# EAGLE design UNO-Rev3 Breakout v10 (EAGLE 9.6.2)
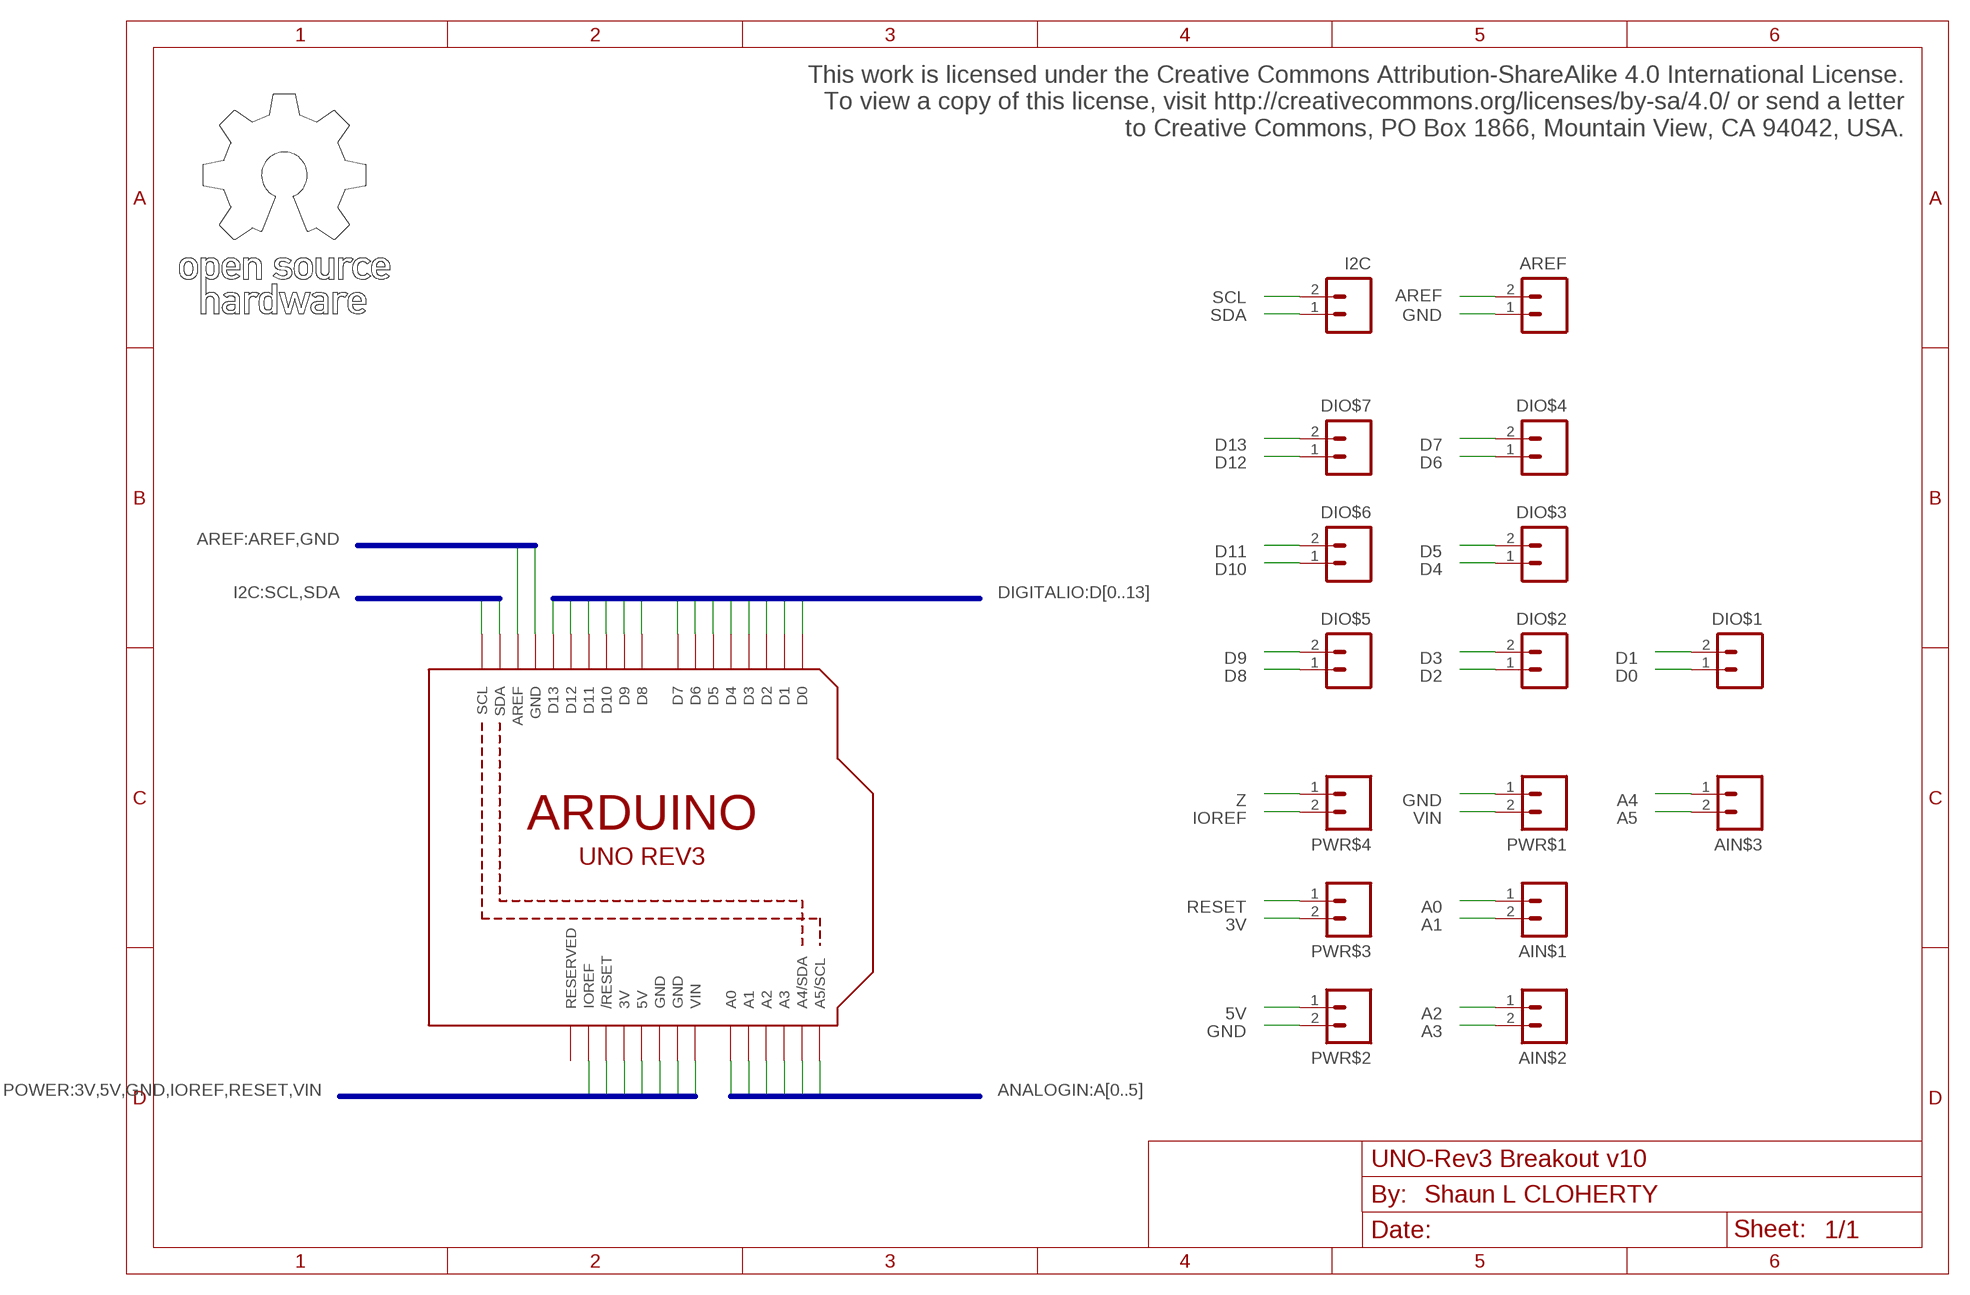
[diagram p0: schematic, sheet 1]

## Parts
AIN$1  2-WAY_3.5MM_SCREWTERMINALMINIMAL  [DINKEL-1X2-3.5MMSCREW_MINIMAL]
AIN$2  2-WAY_3.5MM_SCREWTERMINALMINIMAL  [DINKEL-1X2-3.5MMSCREW_MINIMAL]
AIN$3  2-WAY_3.5MM_SCREWTERMINALMINIMAL  [DINKEL-1X2-3.5MMSCREW_MINIMAL]
AREF  2-WAY_3.5MM_SCREWTERMINALMINIMAL  [DINKEL-1X2-3.5MMSCREW_MINIMAL]
DIO$1  2-WAY_3.5MM_SCREWTERMINALMINIMAL  [DINKEL-1X2-3.5MMSCREW_MINIMAL]
DIO$2  2-WAY_3.5MM_SCREWTERMINALMINIMAL  [DINKEL-1X2-3.5MMSCREW_MINIMAL]
DIO$3  2-WAY_3.5MM_SCREWTERMINALMINIMAL  [DINKEL-1X2-3.5MMSCREW_MINIMAL]
DIO$4  2-WAY_3.5MM_SCREWTERMINALMINIMAL  [DINKEL-1X2-3.5MMSCREW_MINIMAL]
DIO$5  2-WAY_3.5MM_SCREWTERMINALMINIMAL  [DINKEL-1X2-3.5MMSCREW_MINIMAL]
DIO$6  2-WAY_3.5MM_SCREWTERMINALMINIMAL  [DINKEL-1X2-3.5MMSCREW_MINIMAL]
DIO$7  2-WAY_3.5MM_SCREWTERMINALMINIMAL  [DINKEL-1X2-3.5MMSCREW_MINIMAL]
I2C  2-WAY_3.5MM_SCREWTERMINALMINIMAL  [DINKEL-1X2-3.5MMSCREW_MINIMAL]
PWR$1  2-WAY_3.5MM_SCREWTERMINALMINIMAL  [DINKEL-1X2-3.5MMSCREW_MINIMAL]
PWR$2  2-WAY_3.5MM_SCREWTERMINALMINIMAL  [DINKEL-1X2-3.5MMSCREW_MINIMAL]
PWR$3  2-WAY_3.5MM_SCREWTERMINALMINIMAL  [DINKEL-1X2-3.5MMSCREW_MINIMAL]
PWR$4  2-WAY_3.5MM_SCREWTERMINALMINIMAL  [DINKEL-1X2-3.5MMSCREW_MINIMAL]
U$1  ARDUINO-UNO-REV3_SHIELD  [ARDUINOR3_SHORT_NOLABELS]
U$6  OSHW_LOGO  [OSHW_10MM]

## Nets
3V: PWR$3.2 U$1.3V
5V: PWR$2.1 U$1.5V
A0: AIN$1.1 U$1.A0
A1: AIN$1.2 U$1.A1
A2: AIN$2.1 U$1.A2
A3: AIN$2.2 U$1.A3
A4: AIN$3.1 U$1.A4(A4/SDA)
A5: AIN$3.2 U$1.A5(A5/SCL)
AREF: AREF.2 U$1.AREF
D0: DIO$1.1 U$1.D0
D1: DIO$1.2 U$1.D1
D2: DIO$2.1 U$1.D2
D3 [New Class]: DIO$2.2 U$1.D3
D4: DIO$3.1 U$1.D4
D5: DIO$3.2 U$1.D5
D6: DIO$4.1 U$1.D6
D7: DIO$4.2 U$1.D7
D8: DIO$5.1 U$1.D8
D9: DIO$5.2 U$1.D9
D10: DIO$6.1 U$1.D10
D11: DIO$6.2 U$1.D11
D12: DIO$7.1 U$1.D12
D13: DIO$7.2 U$1.D13
GND: AREF.1 PWR$1.1 PWR$2.2 U$1.GND U$1.GND@1(GND) U$1.GND@2(GND)
IOREF: PWR$4.2 U$1.IOREF
RESET: PWR$3.1 U$1.RESET(/RESET)
SCL: I2C.2 U$1.SCL
SDA: I2C.1 U$1.SDA
VIN: PWR$1.2 U$1.VIN
Z: PWR$4.1
Unconnected: U$1.RESERVED

## Buses
DIGITALIO:D[0..13]
ANALOGIN:A[0..5]
POWER:3V,5V,GND,IOREF,RESET,VIN
I2C:SCL,SDA
AREF:AREF,GND

## Notes on the sheet
- This work is licensed under the Creative Commons Attribution-ShareAlike 4.0 International License.
  To view a copy of this license, visit http://creativecommons.org/licenses/by-sa/4.0/ or send a letter
  to Creative Commons, PO Box 1866, Mountain View, CA 94042, USA.

## Library data of the parts
AIN$1-AIN$3 AREF DIO$1-DIO$7 I2C PWR$1-PWR$4 = 00shaunc:2-WAY_3.5MM_SCREWTERMINAL: Dinkle ED350V-02P Interlocking 2-Way 3.5mm PCB Mount Screw Terminal Block. Use with Altronics Part No.: P2028. The MINIMAL package is actually identical, the minimal footprint just provides for a less cluttered silkscreen overlay.
U$1 = 00shaunc:ARDUINO-UNO-REV3_SHIELD: Arduino UNO Rev3 Shield w/o ICSP header. Symbol and footprint(s) derived from those in the Adafruit Eagle library (Version 2, Oct 25 2018). See https://library.io/libraries/420-adafruit (Accessed 2023-06-27).
U$6 = 00shaunc:OSHW_LOGO: OSHW Logo (w/ text) Based on Jonathan Greig's version of the logo in DXF format... c.f. https://github.com/redteam316/oshw-logo/blob/gh-pages/logos/OSHW-Logo-R2000.dxf (Accessed 2023-06-30).

## Board
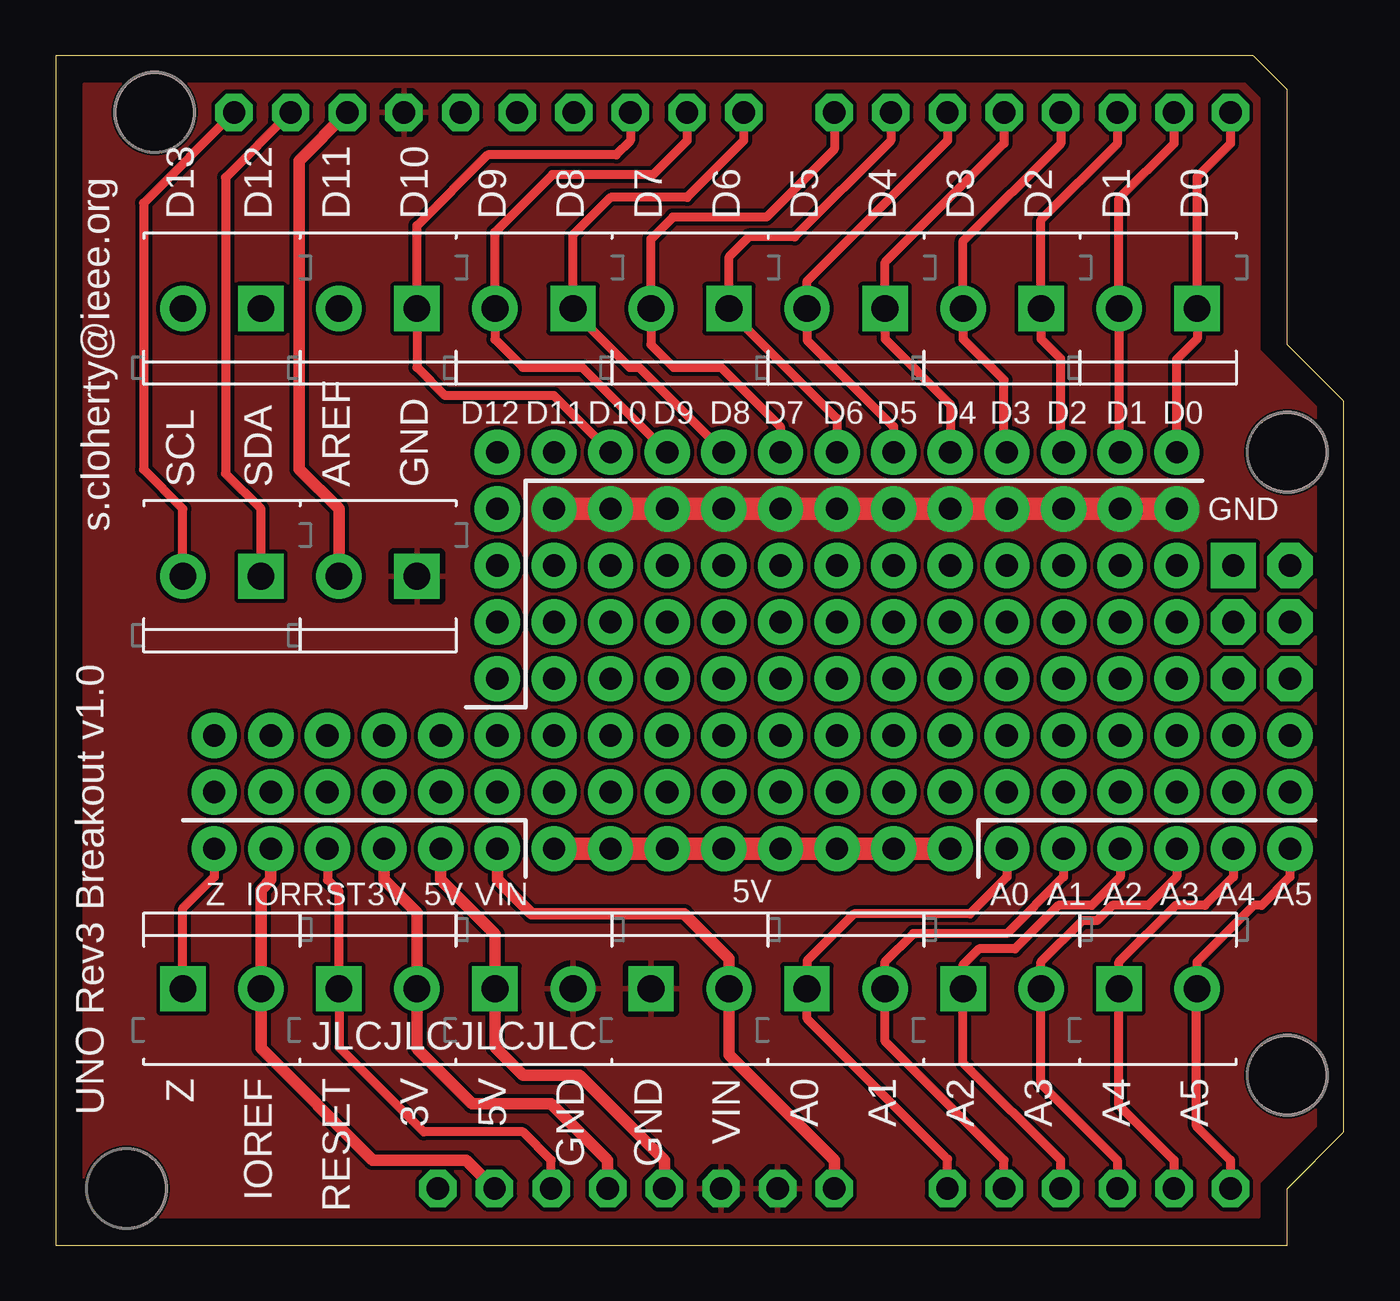
[diagram p1: board, top side]
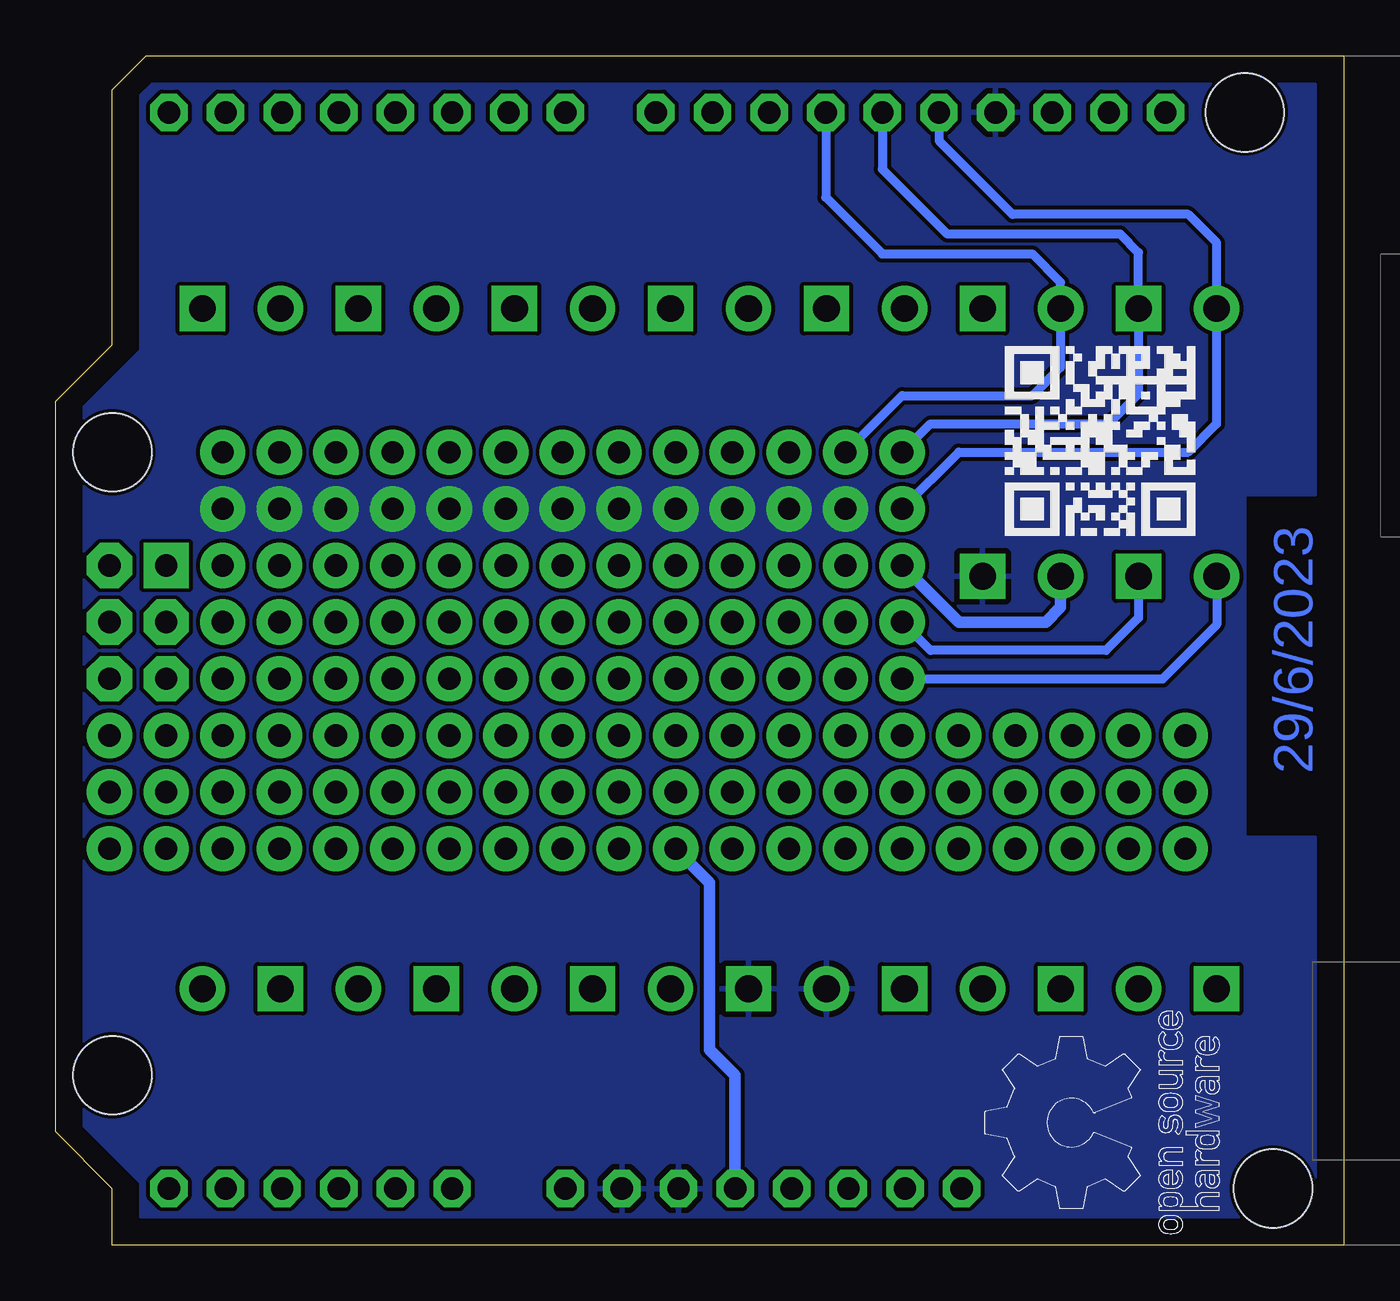
[diagram p2: board, bottom side, seen from below]

Size 57.78 x 53.34 mm. Coordinates in mm from the lower left corner, seen from the top.
Copper layers (1*16): Top 0.035mm / dielectric 1.5mm / Bottom 0.035mm
Design rules "SparkFun-2-Layer-General-JLCPCB": minimum track width 7mil, minimum drill 0.3mm, track to track 7mil, track to pad 7mil, pad to pad 7mil, via to via 7mil, smd to smd 7mil, copper to edge 7mil, drill to drill 7mil, minimum pad ring 7mil, minimum via ring 7mil, stop-mask expansion 3mil, vias tented up to drill 25mil, thermal gap 10mil

### Footprints (pad centres in the part's own frame; a part is rotated, then mirrored left to right if it is on the bottom)
DINKEL-1X2-3.5MMSCREW_MINIMAL = drill 1.2 pad 2.032 square: 1 0,0 | drill 1.2 pad 2.032: 2 3.5,0
ARDUINOR3_SHORT_NOLABELS = drill 1 pad 1.676 octagon: 3V 35.56,2.54; 5V 38.1,2.54; A0 50.8,2.54; A1 53.34,2.54; A2 55.88,2.54; A3 58.42,2.54; A4 60.96,2.54; A5 63.5,2.54; AREF 23.876,50.8; D0 63.5,50.8; D1 60.96,50.8; D2 58.42,50.8; D3 55.88,50.8; D4 53.34,50.8; D5 50.8,50.8; D6 48.26,50.8; D7 45.72,50.8; D8 41.656,50.8; D9 39.116,50.8; D10 36.576,50.8; D11 34.036,50.8; D12 31.496,50.8; D13 28.956,50.8; GND 26.416,50.8; GND@1 43.18,2.54; GND@2 40.64,2.54; IOREF 30.48,2.54; RESERVED 27.94,2.54; RESET 33.02,2.54; SCL 18.796,50.8; SDA 21.336,50.8; VIN 45.72,2.54
STAND-OFF = hole 3.5: 0,0

### Placement (x,y rotation side)
AIN$1  33.7,11.5 0 top
AIN$2  40.7,11.5 0 top
AIN$3  47.7,11.5 0 top
AREF  16.2,30 180 top
DIO$1  51.2,42 180 top
DIO$2  44.2,42 180 top
DIO$3  37.2,42 180 top
DIO$4  30.2,42 180 top
DIO$5  23.2,42 180 top
DIO$6  16.2,42 180 top
DIO$7  9.21,42 180 top
I2C  9.21,30 180 top
PWR$1  26.7,11.5 0 top
PWR$2  19.7,11.5 0 top
PWR$3  12.71,11.5 0 top
PWR$4  5.71,11.5 0 top
U$1  -10.79,0 0 top
U$2  [STAND-OFF]  4.45,50.8 0 top
U$3  [STAND-OFF]  3.18,2.54 0 top
U$4  [STAND-OFF]  55.25,35.56 0 top
U$5  [STAND-OFF]  55.25,7.62 0 top
U$6  5.59,0.51 90 bottom
U$8  [QRCODE_GITHUB_8.5MM]  10.92,36.07 90 bottom

### Tracks (layer width: path | path; a pad name or v marks a point on that pad's centre or on a via)
3V  (via drill 1 pad 2.03)
  Top 0.508: U$1.3V 24.77,3.81 22.23,6.35 18.67,6.35 16.2,8.81 PWR$3.2 16.2,14.91 14.73,16.38 v14.73,17.78
5V  (via drill 1 pad 2.03)
  Top 0.406: 19.7,13.95 19.69,13.97
  Top 0.508: U$1.5V 27.3,3.81 23.49,7.62 20.95,7.62 19.7,8.87 PWR$2.1 19.7,13.95 | v17.27,17.78 17.27,16.38 19.69,13.97
  Top 1.016: v22.35,17.78 v24.89,17.78 v27.43,17.78 v29.97,17.78 v32.51,17.78 v35.05,17.78 v37.59,17.78 v40.13,17.78
  Bottom 0.508: U$1.5V 27.3,7.62 28.45,8.76 28.45,16.26 v29.97,17.78
A0  (via drill 1 pad 2.03)
  Top 0.406: U$1.A0 40,3.86 33.7,10.16 AIN$1.1 33.7,12.75 35.81,14.86 41.02,14.86 42.67,16.51 v42.67,17.78
A1  (via drill 1 pad 2.03)
  Top 0.406: U$1.A1 42.55,3.81 37.2,9.15 AIN$1.2 37.2,12.7 38.48,13.97 42.67,13.97 45.21,16.51 v45.21,17.78
A2  (via drill 1 pad 2.03)
  Top 0.406: U$1.A2 45.09,3.81 40.7,8.19 AIN$2.1 40.7,12.57 41.42,13.28 43.03,13.28 44.99,15.24 46.48,15.24 47.75,16.51 v47.75,17.78
A3  (via drill 1 pad 2.03)
  Top 0.406: U$1.A3 47.62,3.81 44.2,7.23 AIN$2.2 44.2,12.7 46.06,14.55 46.71,14.55 47.4,15.24 49.02,15.24 50.29,16.51 v50.29,17.78
A4  (via drill 1 pad 2.03)
  Top 0.406: U$1.A4 50.16,3.81 47.7,6.27 AIN$3.1 47.7,12.7 50.24,15.24 51.56,15.24 52.83,16.51 v52.83,17.78
A5  (via drill 1 pad 2.03)
  Top 0.178: 51.18,11.48 AIN$3.2
  Top 0.406: U$1.A5 52.7,3.81 51.18,5.33 51.18,11.48 | v55.37,17.78 55.37,16.51 54.1,15.24 53.75,15.24 51.2,12.7 AIN$3.2
AREF  (via drill 1 pad 2.03)
  Top 0.508: U$1.AREF 10.92,48.64 10.92,34.8 12.71,33.02 AREF.2
  Bottom 0.508: v19.81,30.48 17.27,27.94 13.37,27.94 12.71,28.6 AREF.2
D0  (via drill 1 pad 2.03)
  Top 0.406: U$1.D0 52.7,49.4 51.2,47.9 DIO$1.1 51.2,40.64 50.29,39.73 v50.29,35.56
D1  (via drill 1 pad 2.03)
  Top 0.406: U$1.D1 50.16,49.4 47.7,46.94 DIO$1.2 47.7,35.61 v47.75,35.56
D2  (via drill 1 pad 2.03)
  Top 0.406: U$1.D2 47.62,49.4 44.2,45.98 DIO$2.1 44.2,40.64 45.09,39.76 45.09,35.69 v45.21,35.56
D3  (via drill 1 pad 2.03)
  Top 0.406: U$1.D3 45.09,49.4 40.7,45.02 DIO$2.2 40.7,40.64 42.55,38.8 42.55,35.69 v42.67,35.56
D4  (via drill 1 pad 2.03)
  Top 0.406: U$1.D4 42.55,49.41 37.2,44.07 DIO$3.1 37.2,40.64 40.13,37.72 v40.13,35.56
D5  (via drill 1 pad 2.03)
  Top 0.406: U$1.D5 40,49.53 33.7,43.23 DIO$3.2 33.7,40.59 37.59,36.7 v37.59,35.56
D6  (via drill 1 pad 2.03)
  Top 0.406: U$1.D6 37.46,49.53 33.15,45.21 31.09,45.21 30.2,44.32 DIO$4.1 30.2,41.91 35.05,37.06 v35.05,35.56
D7  (via drill 1 pad 2.03)
  Top 0.406: U$1.D7 34.92,49.15 31.88,46.1 27.69,46.1 26.7,45.12 DIO$4.2 26.7,40.39 27.72,39.37 29.84,39.37 32.51,36.7 v32.51,35.56
D8  (via drill 1 pad 2.03)
  Top 0.406: U$1.D8 30.86,49.53 28.32,46.99 24.89,46.99 23.2,45.3 DIO$5.1 23.2,41.91 25.74,39.37 26.16,39.37 v29.97,35.56
D9  (via drill 1 pad 2.03)
  Top 0.406: U$1.D9 28.32,49.53 26.8,48.01 22.28,48.01 19.7,45.43 DIO$5.2 19.7,40.62 20.95,39.37 23.62,39.37 v27.43,35.56
D10  (via drill 1 pad 2.03)
  Top 0.406: U$1.D10 25.78,49.53 25.15,48.9 19.38,48.9 16.2,45.72 DIO$6.1 16.2,39.37 17.48,38.1 22.35,38.1 v24.89,35.56
D11  (via drill 1 pad 2.03)
  Bottom 0.406: U$1.D11 23.24,46.99 20.7,44.45 13.97,44.45 12.71,43.18 DIO$6.2 12.71,39.37 13.97,38.1 19.81,38.1 v22.35,35.56
D12  (via drill 1 pad 2.03)
  Bottom 0.406: U$1.D12 20.7,48.26 17.78,45.34 10.03,45.34 9.21,44.51 DIO$7.1 9.21,38.17 10.54,36.83 18.54,36.83 v19.81,35.56
D13  (via drill 1 pad 2.03)
  Bottom 0.406: U$1.D13 18.16,49.53 14.86,46.23 6.99,46.23 5.71,44.95 DIO$7.2 5.72,36.83 6.99,35.56 17.27,35.56 v19.81,33.02
GND  (via drill 1 pad 2.03)
  Top 1.016: v22.35,33.02 v24.89,33.02 v27.43,33.02 v29.97,33.02 v32.51,33.02 v35.05,33.02 v37.59,33.02 v40.13,33.02 v42.67,33.02 v45.21,33.02 v47.75,33.02 v50.29,33.02
  pour Top: 1.9,1.27 1.27,1.27 1.27,52.07 53.34,52.07 53.97,51.44 53.97,50.8 53.97,40.13 56.52,37.59 56.52,35.56 56.52,5.33 53.97,2.79 53.97,1.27
  pour Bottom: 1.27,52.07 53.47,52.07 53.97,51.56 53.97,40.13 56.52,37.59 56.52,5.33 53.97,2.79 53.97,1.27 1.27,1.27 1.27,18.29 4.45,18.29 4.45,33.66 1.27,33.66
IOREF  (via drill 1 pad 2.03)
  Top 0.508: U$1.IOREF 18.41,3.81 14.22,3.81 9.21,8.83 PWR$4.2 9.21,15.94 9.65,16.38 v9.65,17.78
N$1  (via drill 1 pad 2.03)
  other vias: 12.19,22.86
N$2  (via drill 1 pad 2.03)
  other vias: 12.19,20.32
N$3  (via drill 1 pad 2.03)
  other vias: 7.11,22.86
N$4  (via drill 1 pad 2.03)
  other vias: 7.11,20.32
N$6  (via drill 1 pad 2.03)
  other vias: 9.65,22.86
N$7  (via drill 1 pad 2.03)
  other vias: 9.65,20.32
N$10  (via drill 1 pad 2.03)
  other vias: 14.73,22.86
N$11  (via drill 1 pad 2.03)
  other vias: 14.73,20.32
N$13  (via drill 1 pad 2.03)
  other vias: 17.27,22.86
N$14  (via drill 1 pad 2.03)
  other vias: 17.27,20.32
N$21  (via drill 1 pad 2.03)
  other vias: 19.81,22.86
N$22  (via drill 1 pad 2.03)
  other vias: 19.81,20.32
N$26  (via drill 1 pad 2.03)
  other vias: 22.35,30.48
N$27  (via drill 1 pad 2.03)
  other vias: 22.35,27.94
N$28  (via drill 1 pad 2.03)
  other vias: 22.35,25.4
N$29  (via drill 1 pad 2.03)
  other vias: 22.35,22.86
N$30  (via drill 1 pad 2.03)
  other vias: 22.35,20.32
N$34  (via drill 1 pad 2.03)
  other vias: 24.89,30.48
N$35  (via drill 1 pad 2.03)
  other vias: 24.89,27.94
N$36  (via drill 1 pad 2.03)
  other vias: 24.89,25.4
N$37  (via drill 1 pad 2.03)
  other vias: 24.89,22.86
N$38  (via drill 1 pad 2.03)
  other vias: 24.89,20.32
N$42  (via drill 1 pad 2.03)
  other vias: 27.43,30.48
N$43  (via drill 1 pad 2.03)
  other vias: 27.43,27.94
N$44  (via drill 1 pad 2.03)
  other vias: 27.43,25.4
N$45  (via drill 1 pad 2.03)
  other vias: 27.43,22.86
N$46  (via drill 1 pad 2.03)
  other vias: 27.43,20.32
N$50  (via drill 1 pad 2.03)
  other vias: 29.97,30.48
N$51  (via drill 1 pad 2.03)
  other vias: 29.97,27.94
N$52  (via drill 1 pad 2.03)
  other vias: 29.97,25.4
N$53  (via drill 1 pad 2.03)
  other vias: 29.97,22.86
N$54  (via drill 1 pad 2.03)
  other vias: 29.97,20.32
N$58  (via drill 1 pad 2.03)
  other vias: 32.51,30.48
N$59  (via drill 1 pad 2.03)
  other vias: 32.51,27.94
N$60  (via drill 1 pad 2.03)
  other vias: 32.51,25.4
N$61  (via drill 1 pad 2.03)
  other vias: 32.51,22.86
N$62  (via drill 1 pad 2.03)
  other vias: 32.51,20.32
N$66  (via drill 1 pad 2.03)
  other vias: 35.05,30.48
N$67  (via drill 1 pad 2.03)
  other vias: 35.05,27.94
N$68  (via drill 1 pad 2.03)
  other vias: 35.05,25.4
N$69  (via drill 1 pad 2.03)
  other vias: 35.05,22.86
N$70  (via drill 1 pad 2.03)
  other vias: 35.05,20.32
N$74  (via drill 1 pad 2.03)
  other vias: 37.59,30.48
N$75  (via drill 1 pad 2.03)
  other vias: 37.59,27.94
N$76  (via drill 1 pad 2.03)
  other vias: 37.59,25.4
N$77  (via drill 1 pad 2.03)
  other vias: 37.59,22.86
N$78  (via drill 1 pad 2.03)
  other vias: 37.59,20.32
N$82  (via drill 1 pad 2.03)
  other vias: 40.13,30.48
N$83  (via drill 1 pad 2.03)
  other vias: 40.13,27.94
N$84  (via drill 1 pad 2.03)
  other vias: 40.13,25.4
N$85  (via drill 1 pad 2.03)
  other vias: 40.13,22.86
N$86  (via drill 1 pad 2.03)
  other vias: 40.13,20.32
N$90  (via drill 1 pad 2.03)
  other vias: 42.67,30.48
N$91  (via drill 1 pad 2.03)
  other vias: 42.67,27.94
N$92  (via drill 1 pad 2.03)
  other vias: 42.67,25.4
N$93  (via drill 1 pad 2.03)
  other vias: 42.67,22.86
N$94  (via drill 1 pad 2.03)
  other vias: 42.67,20.32
N$98  (via drill 1 pad 2.03)
  other vias: 45.21,30.48
N$99  (via drill 1 pad 2.03)
  other vias: 45.21,27.94
N$100  (via drill 1 pad 2.03)
  other vias: 45.21,25.4
N$101  (via drill 1 pad 2.03)
  other vias: 45.21,22.86
N$102  (via drill 1 pad 2.03)
  other vias: 45.21,20.32
N$106  (via drill 1 pad 2.03)
  other vias: 47.75,30.48
N$107  (via drill 1 pad 2.03)
  other vias: 47.75,27.94
N$108  (via drill 1 pad 2.03)
  other vias: 47.75,25.4
N$109  (via drill 1 pad 2.03)
  other vias: 47.75,22.86
N$110  (via drill 1 pad 2.03)
  other vias: 47.75,20.32
N$114  (via drill 1 pad 2.03)
  other vias: 50.29,30.48
N$115  (via drill 1 pad 2.03)
  other vias: 50.29,27.94
N$116  (via drill 1 pad 2.03)
  other vias: 50.29,25.4
N$117  (via drill 1 pad 2.03)
  other vias: 50.29,22.86
N$118  (via drill 1 pad 2.03)
  other vias: 50.29,20.32
N$120  (via drill 1 pad 2.03)
  other vias: 52.83,30.48
N$121  (via drill 1 pad 2.03)
  other vias: 52.83,27.94
N$122  (via drill 1 pad 2.03)
  other vias: 52.83,25.4
N$123  (via drill 1 pad 2.03)
  other vias: 52.83,22.86
N$124  (via drill 1 pad 2.03)
  other vias: 52.83,20.32
N$126  (via drill 1 pad 2.03)
  other vias: 55.37,30.48
N$127  (via drill 1 pad 2.03)
  other vias: 55.37,27.94
N$128  (via drill 1 pad 2.03)
  other vias: 55.37,25.4
N$129  (via drill 1 pad 2.03)
  other vias: 55.37,22.86
N$130  (via drill 1 pad 2.03)
  other vias: 55.37,20.32
RESET  (via drill 1 pad 2.03)
  Top 0.406: U$1.RESET 22.23,3.81 20.95,5.08 16.51,5.08 12.71,8.88 PWR$3.1 12.71,15.87 12.19,16.38 v12.19,17.78
SCL  (via drill 1 pad 2.03)
  Top 0.406: U$1.SCL 3.94,46.74 3.94,34.79 5.71,33.02 I2C.2
  Bottom 0.406: v19.81,25.4 8.13,25.4 5.71,27.82 I2C.2
SDA  (via drill 1 pad 2.03)
  Top 0.406: U$1.SDA 7.62,47.88 7.62,34.6 9.21,33.02 I2C.1
  Bottom 0.406: v19.81,27.94 18.54,26.67 10.67,26.67 9.21,28.13 I2C.1
VIN  (via drill 1 pad 2.03)
  Top 0.508: U$1.VIN 34.92,3.81 30.2,8.53 PWR$1.2 30.2,12.85 28.19,14.86 21.34,14.86 19.81,16.38 v19.81,17.78
Z  (via drill 1 pad 2.03)
  Top 0.406: v7.11,17.78 7.11,16.51 5.71,15.1 PWR$4.1

### Text on the board
Bottom: 29/6/2023
tPlace: JLCJLCJLCJLC
tNames: D13 | D12 | D11 | D10 | D9 | D8 | D7 | D6 | D5 | D4 | D3 | D2 | D1 | D0 | D12 | D11 | D10 | D9 | D8 | D7 | D6 | D5 | D4 | D3 | D2 | D1 | D0 | SCL | SDA | AREF | GND | GND | s.cloherty@ieee.org | Z | IOR | RST | 3V | 5V | VIN | 5V | A0 | A1 | A2 | A3 | A4 | A5 | Z | IOREF | RESET | 3V | 5V | GND | GND | VIN | A0 | A1 | A2 | A3 | A4 | A5 | UNO Rev3 Breakout v1.0